# EasyEDA schematic SCH_BotMark_2026-06-07.json
TITLE: PB_robot; REV: 1.0; Date: 2026-05-25; Sheet: 1/1; Drawn By: joanmarcpro; Company: BotMark
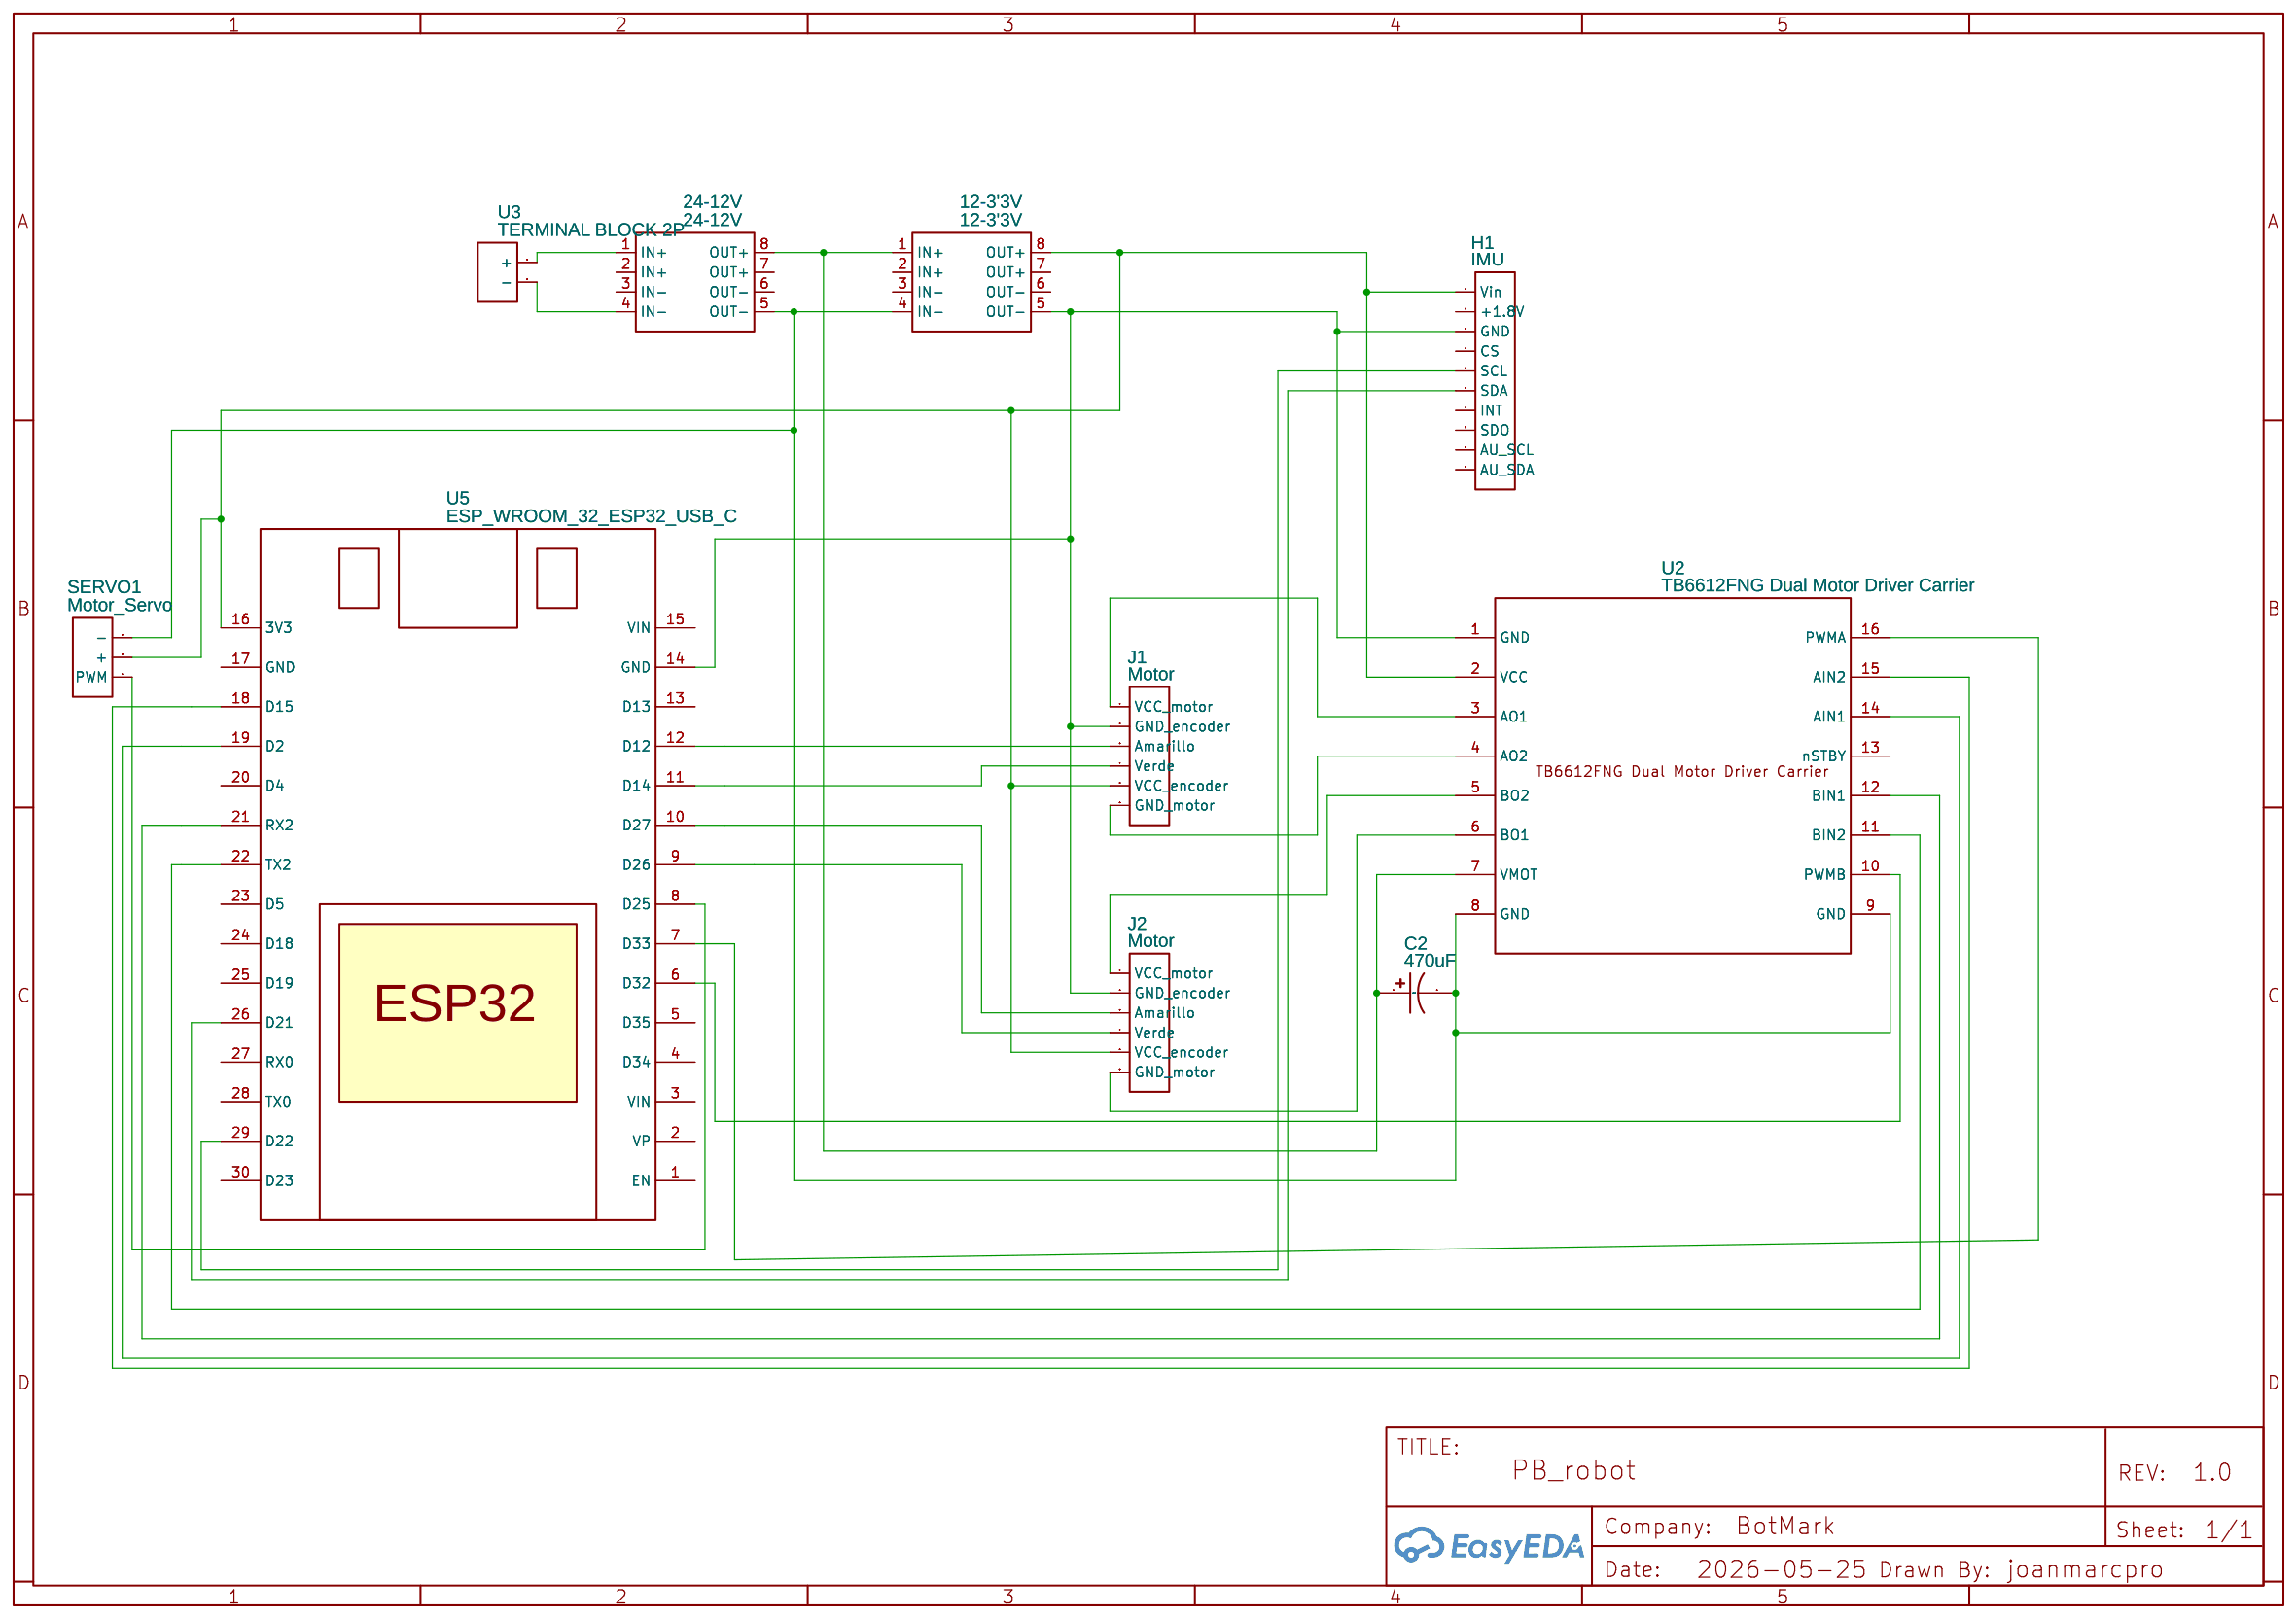
[diagram p0: schematic sheet]

## Parts
12-3'3V  12-3'3V  [PWRM-TH_MP1584EN_MOUDLE]
24-12V  24-12V  [PWRM-TH_MP1584EN_MOUDLE]
C2  470uF  [CAP-D6.3×F2.5]
H1  IMU  [HDR-F-2.54_1X10]
J1  Motor  [HDR-M-2.54_1X6]
J2  Motor  [HDR-M-2.54_1X6]
SERVO1  Motor_Servo  [HDR-M-2.54_1X3]
U2  TB6612FNG Dual Motor Driver Carrier  [TB6612FNG DUAL MOTOR DRIVER CARRIER]
U3  TERMINAL BLOCK 2P  [BORNERA DOS TERMINALES TERMINAL BLOCK 5MM]
U5  ESP_WROOM_32_ESP32_USB_C  [ESP32_NODEMCU_USB-C]

## Library data of the parts
12-3'3V 24-12V = MP1584EN_MOUDLE: Supplier: LCSC; Supplier Part: C9900223542; Manufacturer: null; Manufacturer Part: MP1584EN_moudle; Contributor: lcsc
C2 = CE_TH_D6.3×F2.5_US: Contributor: LCEDA_Lib
H1 = HDR-F-2.54_1x10: Supplier Part: C35445; Supplier: LCSC; Contributor: LCEDA_Lib
J1 J2 = HDR-M-2.54_1x6: Supplier Part: C190819; Supplier: LCSC; Contributor: LCEDA_Lib
SERVO1 = HDR-M-2.54_1x3: Supplier Part: C180248; Supplier: LCSC; Contributor: LCEDA_Lib
U2 = TB6612FNG Dual Motor Driver Carrier: Contributor: winter2015; sourceId: YsmgyP7pj
U3 = TERMINAL BLOCK 2P: Contributor: DARIOELJATIB
U5 = ESP_WROOM_32_ESP32_USB_C: Manufacturer: Flutesan; Manufacturer Part: ESP32; Supplier Part: ‎B09GK74F7N; Supplier: RS-Online; link: https://www.amazon.com/dp/B09GK74F7N; Contributor: jackfulks1

## Nets
Net-(12-3'3V-1): 12-3'3V.1(IN+) 24-12V.8(OUT+) C2.1 U2.7(VMOT)
Net-(12-3'3V-4): 12-3'3V.4(IN-) 24-12V.5(OUT-) C2.2 SERVO1.3(-) U2.8(GND) U2.9(GND)
Net-(12-3'3V-5): 12-3'3V.5(OUT-) H1.3(GND) J1.2(GND encoder) J2.2(GND encoder) U2.1(GND) U5.14(GND)
Net-(12-3'3V-8): 12-3'3V.8(OUT+) H1.1(Vin) J1.5(VCC encoder) J2.5(VCC encoder) SERVO1.2(+) U2.2(VCC) U5.16(3V3)
Net-(24-12V-1): 24-12V.1(IN+) U3.2(+)
Net-(24-12V-4): 24-12V.4(IN-) U3.1(-)
Net-(H1-5): H1.5(SCL) U5.29(D22)
Net-(H1-6): H1.6(SDA) U5.26(D21)
Net-(J1-1): J1.1(VCC motor) U2.3(AO1)
Net-(J1-3): J1.3(Amarillo) U5.12(D12)
Net-(J1-4): J1.4(Verde) U5.11(D14)
Net-(J1-6): J1.6(GND motor) U2.4(AO2)
Net-(J2-1): J2.1(VCC motor) U2.5(BO2)
Net-(J2-3): J2.3(Amarillo) U5.10(D27)
Net-(J2-4): J2.4(Verde) U5.9(D26)
Net-(J2-6): J2.6(GND motor) U2.6(BO1)
Net-(SERVO1-1): SERVO1.1(PWM) U5.8(D25)
Net-(U2-10): U2.10(PWMB) U5.6(D32)
Net-(U2-11): U2.11(BIN2) U5.22(TX2)
Net-(U2-12): U2.12(BIN1) U5.21(RX2)
Net-(U2-14): U2.14(AIN1) U5.19(D2)
Net-(U2-15): U2.15(AIN2) U5.18(D15)
Net-(U2-16): U2.16(PWMA) U5.7(D33)

Not connected (* = marked no-connect by the designer): 12-3'3V 2(IN+) 3(IN-) 6(OUT-) 7(OUT+); 24-12V 2(IN+) 3(IN-) 6(OUT-) 7(OUT+); H1 2(+1.8V) 4(CS) 7(INT) 8(SDO) 9(AU_SCL) 10(AU_SDA); U2 13(nSTBY); U5 1(EN) 2(VP) 3(VIN) 4(D34) 5(D35) 13(D13) 15(VIN) 17(GND) 20(D4) 23(D5) 24(D18) 25(D19) 27(RX0) 28(TX0) 30(D23)
